# Altium schematic sheet ModPowerBlock.SchDoc
size 420 x 297 mm; Address1: Address1; Address2: Address2; Address3: Address3; Address4: Address4; SheetNumber: 1; Scale: 1:1; Разраб.: Лепотенко А.С.; Обозначение документа: ЛАС.4367523.001Э3; Перв. применение: ЛАС.4367523.001; Наименование изделия 1: DC-DC преобразователь; Наименование изделия 2: Схема электрическая; Наименование изделия 3: принципиальная; Нач. отд.: Нач. отд.
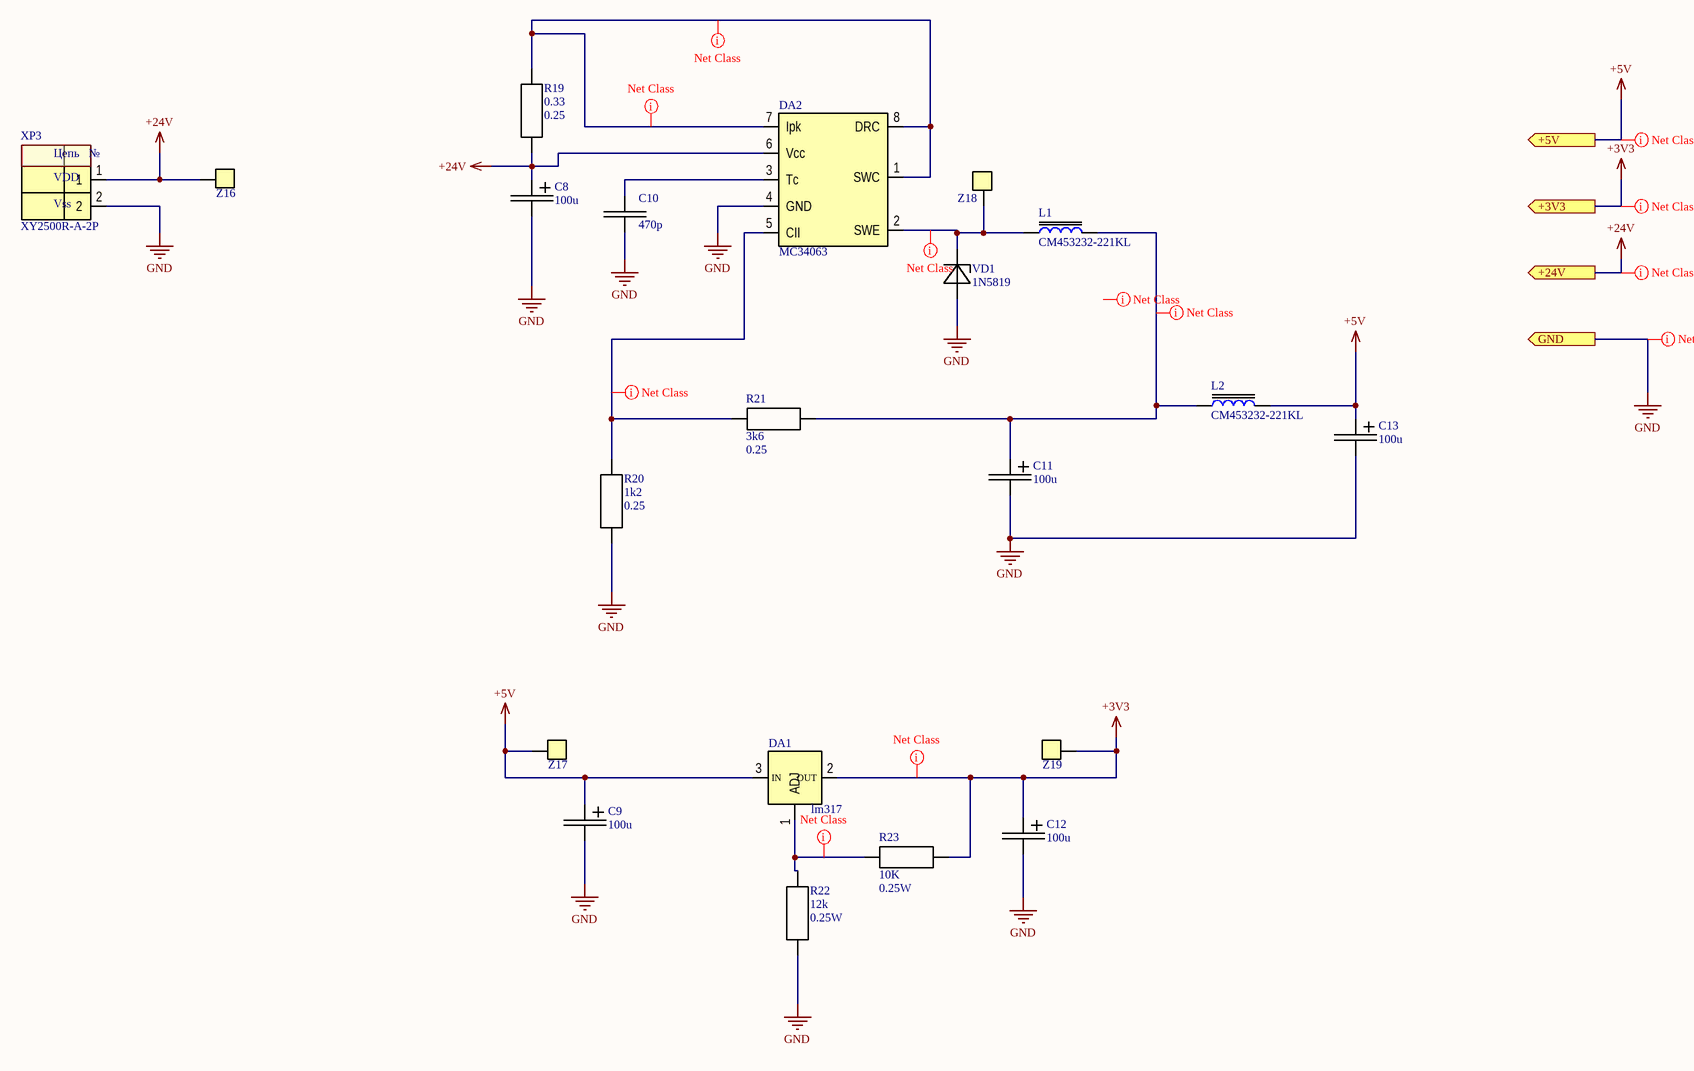
[diagram p0: ModPowerBlock.SchDoc]

## Parts
C8  100u  [CAPAE120103X105MTypeG]
C9  100u  [CAPAE120103X105MTypeG]
C10  470p  [CAP1206]
C11  100u  [CAPAE120103X105MTypeG]
C12  100u  [CAPAE120103X105MTypeG]
C13  100u  [CAPAE120103X105MTypeG]
DA1  lm317  [SOD-223]
DA2  MC34063  [SO-8]
L1  CM453232-221KL  [453232]
L2  CM453232-221KL  [453232]
R19  Power: 0.25  [1206]  (hidden comment: 0.33)
R20  Power: 0.25  [1206]  (hidden comment: 1k2)
R21  Power: 0.25  [1206]  (hidden comment: 3k6)
R22  Power: 0.25W  [1206]  (hidden comment: 12k)
R23  Power: 0.25W  [1206]  (hidden comment: 10k)
VD1  1N5819  [SOD-123]
XP3  XY2500R-A-2P  [KLS2-EDR-500-2P]
Z16  test Point  [test Point]  (value not drawn)
Z17  test Point  [test Point]  (value not drawn)
Z18  test Point  [test Point]  (value not drawn)
Z19  test Point  [test Point]  (value not drawn)

## Ports
+3V3 (out), +5V (out), +24V (out), GND (out)

## Nets
+3V3: C12.1 DA1.2(OUT) R23.2 Z19.1 ; port +3V3
+5V: C9.1 C13.1 DA1.3(IN) L2.2 Z17.1 ; port +5V
+24V: C8.1 DA2.6(Vcc) R19.1 XP3.1 Z16.1 ; port +24V
GND: C8.2 C9.2 C10.2 C11.2 C12.2 C13.2 DA2.4(GND) R20.2 R22.2 VD1.1 XP3.2 ; port GND
NetC10_1: C10.1 DA2.3(Tc)
NetC11_1: C11.1 L1.2 L2.1 R21.2
NetDA1_1: DA1.1(ADJ) R22.1 R23.1
NetDA2_1: DA2.1(SWC) DA2.7(Ipk) DA2.8(DRC) R19.2
NetDA2_2: DA2.2(SWE) L1.1 VD1.2 Z18.1
NetDA2_5: DA2.5(CII) R20.1 R21.1

## Layout directives
net class Power5V_3V3: (no net found under the mark), +3V3, +5V, NetC11_1, NetDA1_1, NetDA2_2, NetDA2_5
net class Power24V: +24V, GND, NetDA2_1

## Notes on the sheet
- Перв. примен.
- Справ. №
- Подп. и дата
- Инв. № дубл.
- Взам. инв. №
- Разраб.
- Изм.
- Лист
- № докум.
- Подп.
- Дата
- Лит.
- Масса
- Масштаб
- Пров.
- Т.контр.
- Листов
- Инв. № подл.
- Утв.
- Н.контр.
- Копировал
- Формат А3
- (in symbol Connector_Power) Цепь; №; VDD; Vss

## Library data of the parts
C8 C9 C11-C13 = Capasitor Electrolit: Part Namber: RC1H107M08010VR; Manufacturer: Samwha; Value: 100uF; Power: 50V; Price: 0.23; ShoppingPlace: http://belchip.by/product/?selected_product=12709; Package: TypeG
C10 = Capasitor: Part Number: 1206471X7R; Manufacturer: FAITHFULL LINK; Voltage: 50V; Value: 470p; Quantity: 4; Package: 1206; Price: 0.02; ShoppingPlace: http://belchip.by/product/?selected_product=00281
DA1 = lm317: Manufacturer: Texas Instruments; Part Number: LM317AEMP/NOPB; Value: 1.5A; Package: SOT-223; Quantity: 1; Price: 2.5; ShoppingPlace: http://belchip.by/product/?selected_product=11445
DA2 = MC34063: part Number: MC34063ADR; Manufacturer: ON Semiconductor; Value: *; Package: SO-8; Price: 0,3; ShoppingPlace: http://belchip.by/product/?selected_product=28823; Quantity: 4
L1 L2 = CM453232-221KL: Manufacturer: Bourns; Value: 220u; Part Number: CM453232-221KL; ShoppingPlace: https://www.ru-chipdip.by/product/cm453232-221kl; Price: 0.225; Package: 1812; Quantity: 2
R19 = Resistor: Manufacturer: Royal Ohm; Part Number: 1206R033; Quntity: 3; Price: 0.5; Package: 1206; ShoppingPlace: http://belchip.by/product/?selected_product=32979; Value: 0.33
R20 = Resistor: Manufacturer: Royal Ohm; Part Number: 1206R122; Quntity: 3; Price: 0.5; Package: 1206; ShoppingPlace: http://belchip.by/product/?selected_product=01386; Value: 1k2
R21 = Resistor: Manufacturer: Royal Ohm; Part Number: 1206R362; Quntity: 3; Price: 0.5; Package: 1206; ShoppingPlace: http://belchip.by/product/?selected_product=01396; Value: 3k6
R22 R23 = Resistor: Manufacturer: YAGEO; Part Number: RC1206FR-0710KL; Quntity: 3; Price: 0.15; Package: 1206
  R22: ShoppingPlace: http://belchip.by/product/?selected_product=01409; Value: 12k
  R23: ShoppingPlace: http://belchip.by/product/?selected_product=30985; Value: 10K
VD1 = 1N5819: Manufacturer: GALAXY; Value: 40V; Power: 1A; Price: 0.12; ShoppingPlace: http://belchip.by/product/?selected_product=08853; Package: SOD-123; Quantity: 3
XP3 = Connector_Power: Value: 500VDC; Package: XY2500R; Part Number: XY2500R-A-2P; Quantity: 1; Price: 0,10; ShoppingPlace: http://belchip.by/product/?selected_product=14514